# EAGLE schematic ShiftReg (EAGLE 8.5.1)
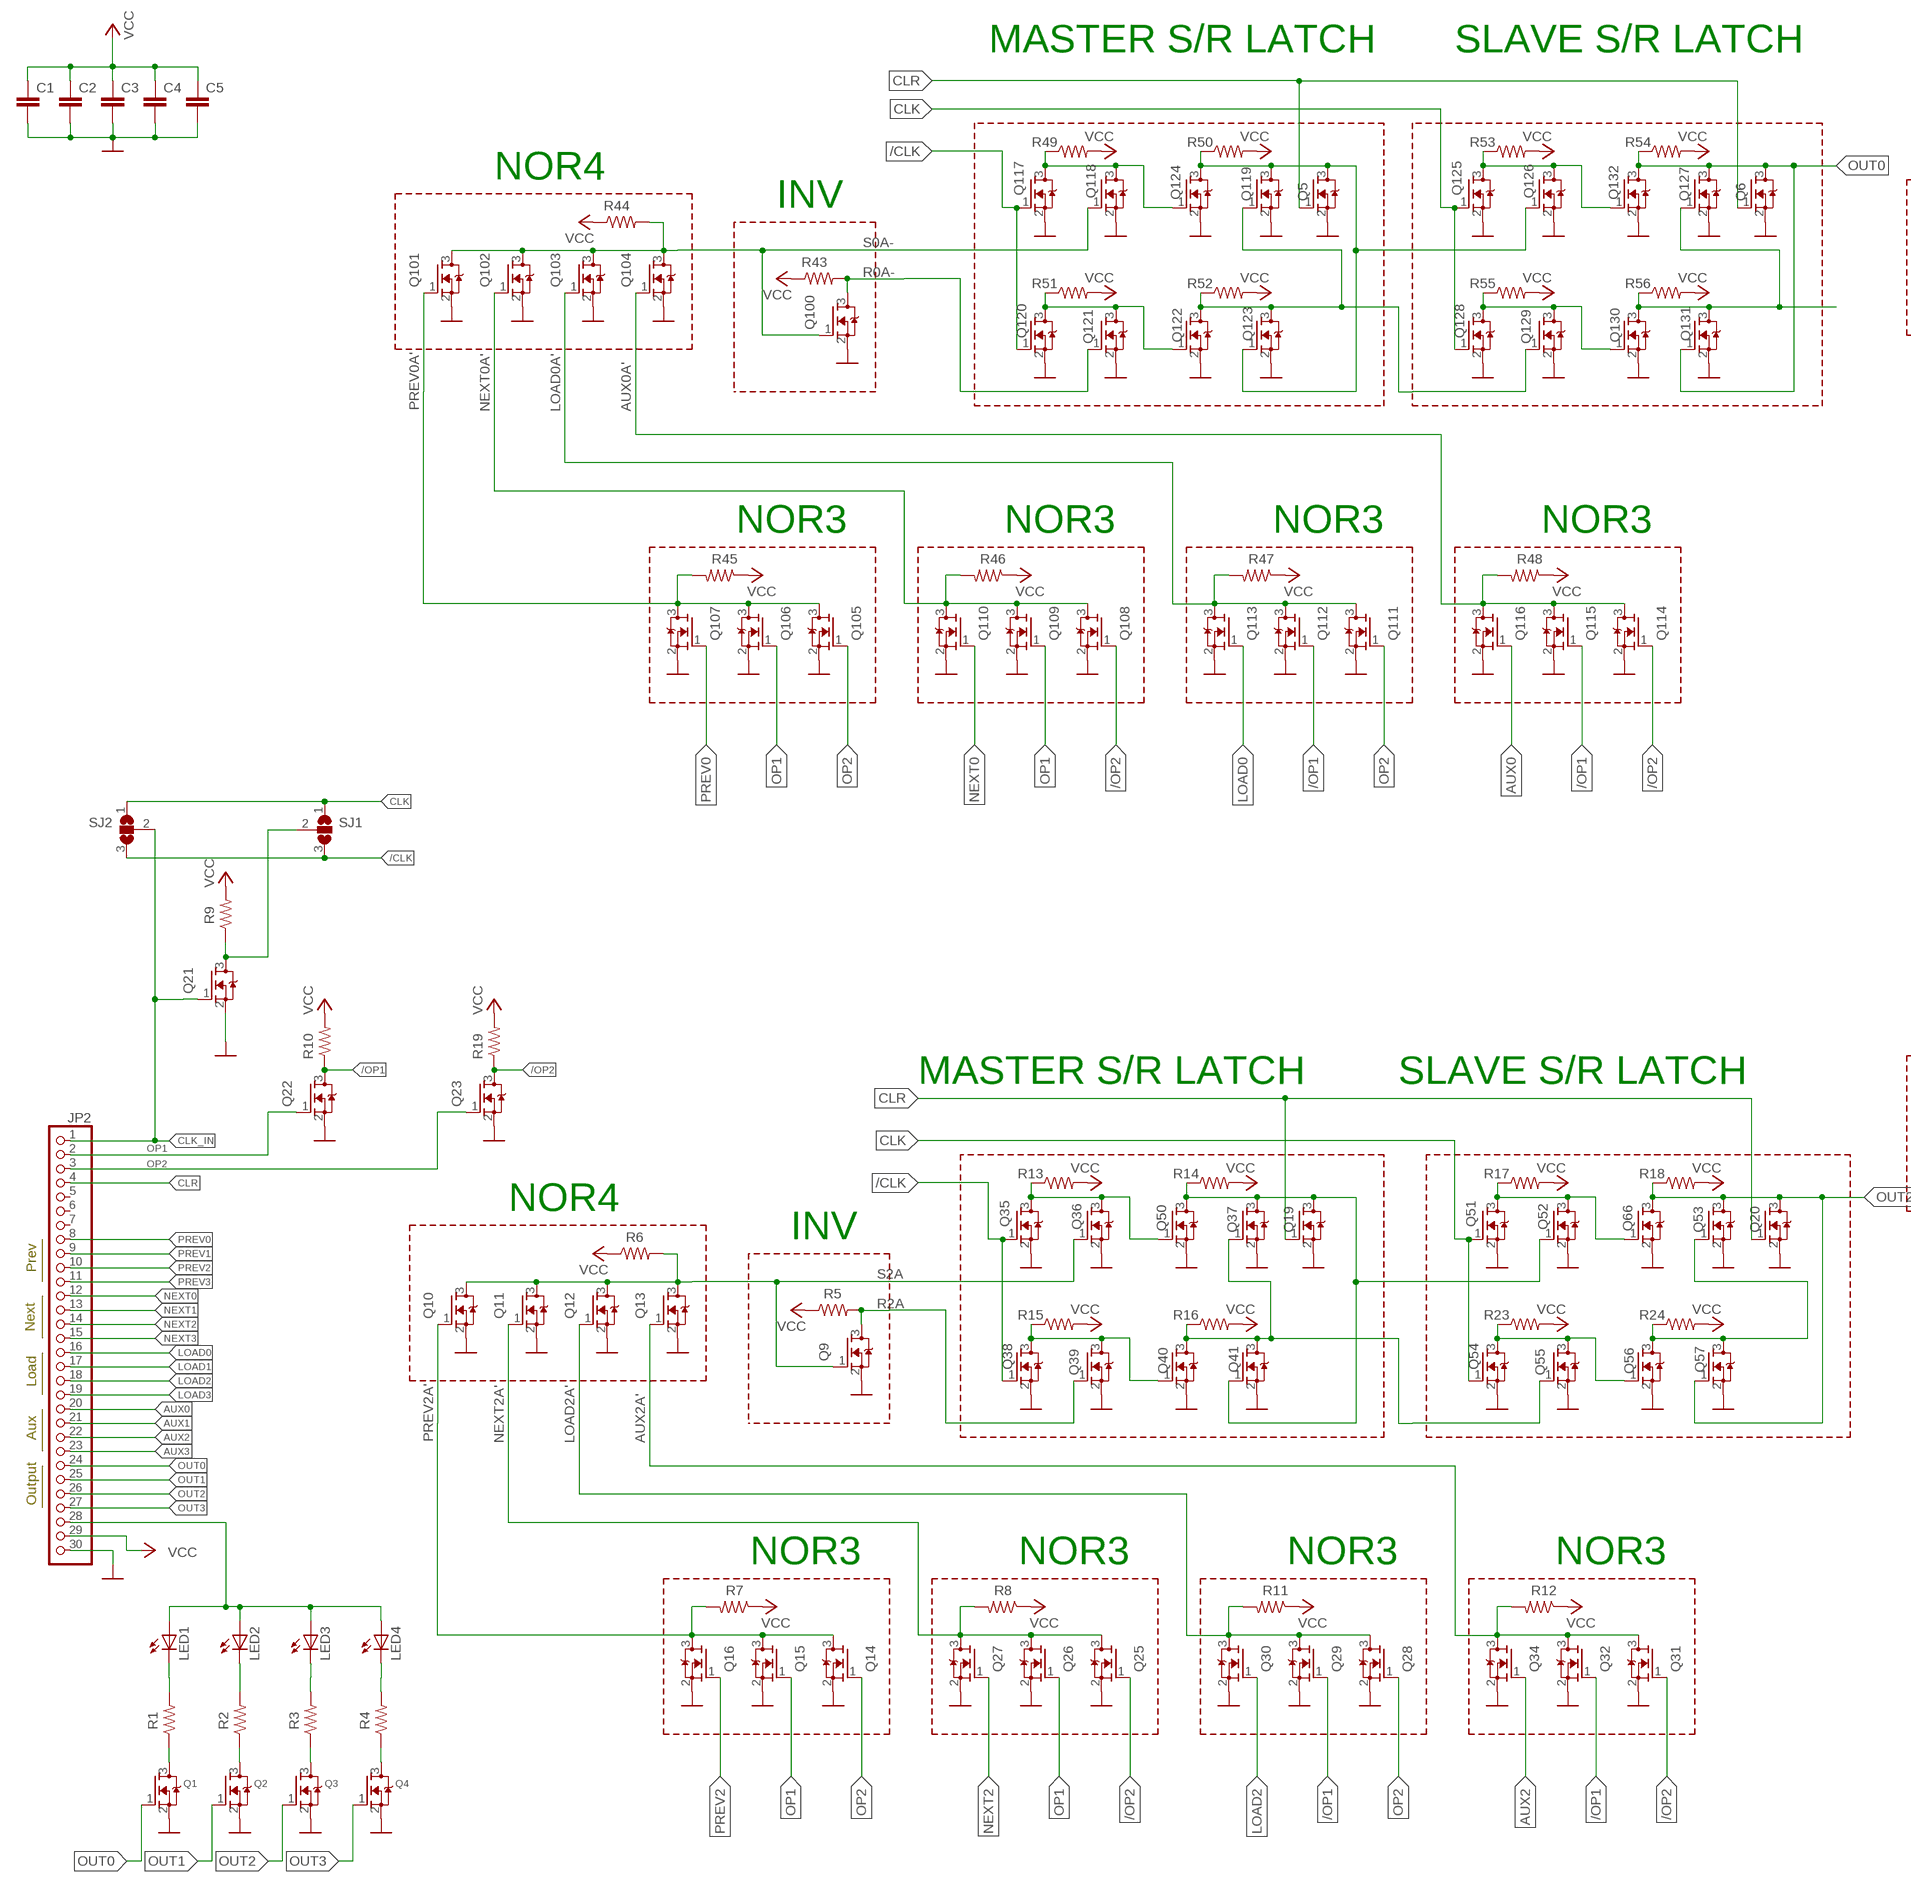
[diagram p0: schematic, sheet 1, part 1 of 2]
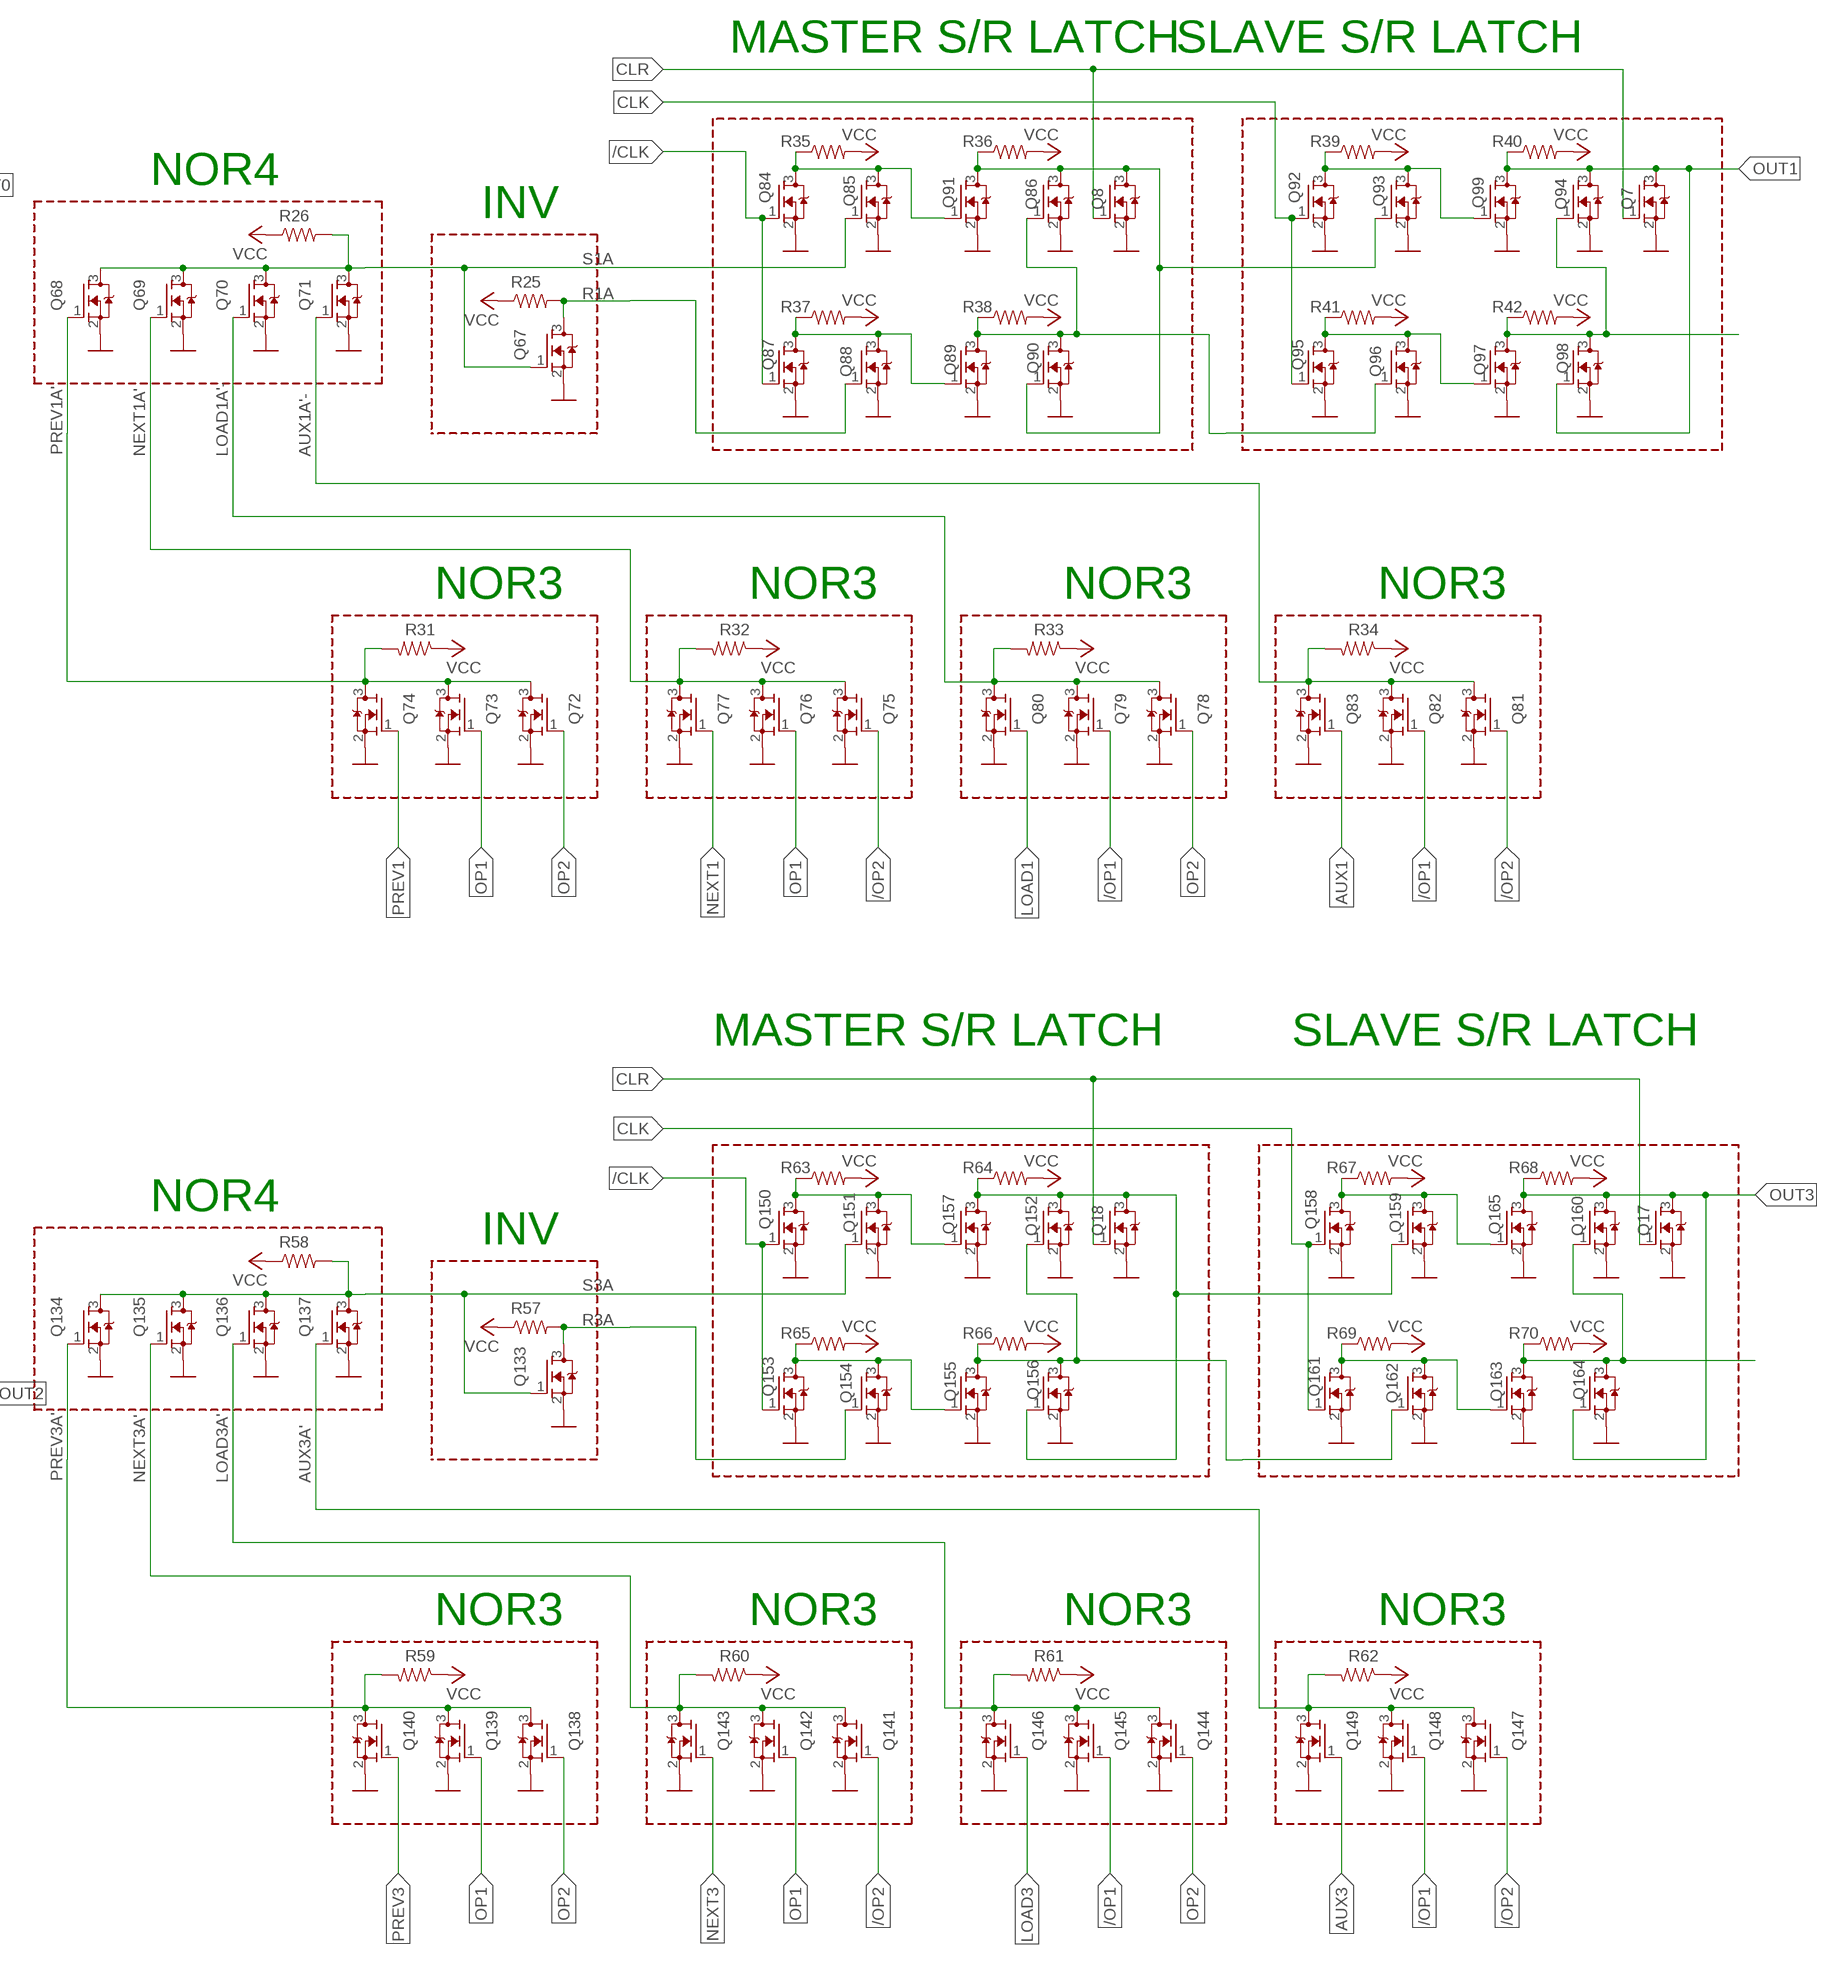
[diagram p1: schematic, sheet 1, part 2 of 2]

## Parts
C1  C-EUC0805K  [C0805K]
C2  C-EUC0805K  [C0805K]
C3  C-EUC0805K  [C0805K]
C4  C-EUC0805K  [C0805K]
C5  C-EUC0805K  [C0805K]
JP2  PINHD-1X30  [1X30]
LED1  LEDSQR2X5  [LED2X5]
LED2  LEDSQR2X5  [LED2X5]
LED3  LEDSQR2X5  [LED2X5]
LED4  LEDSQR2X5  [LED2X5]
Q1  NMOSREFLOW  [SOT23]
Q2  NMOSREFLOW  [SOT23]
Q3  NMOSREFLOW  [SOT23]
Q4  NMOSREFLOW  [SOT23]
Q5  310mA/60V/1.6Ω  NMOSREFLOW  [SOT23]
Q6  310mA/60V/1.6Ω  NMOSREFLOW  [SOT23]
Q7  310mA/60V/1.6Ω  NMOSREFLOW  [SOT23]
Q8  310mA/60V/1.6Ω  NMOSREFLOW  [SOT23]
Q9  310mA/60V/1.6Ω  NMOSREFLOW  [SOT23]
Q10  310mA/60V/1.6Ω  NMOSREFLOW  [SOT23]
Q11  310mA/60V/1.6Ω  NMOSREFLOW  [SOT23]
Q12  310mA/60V/1.6Ω  NMOSREFLOW  [SOT23]
Q13  310mA/60V/1.6Ω  NMOSREFLOW  [SOT23]
Q14  310mA/60V/1.6Ω  NMOSREFLOW  [SOT23]
Q15  310mA/60V/1.6Ω  NMOSREFLOW  [SOT23]
Q16  310mA/60V/1.6Ω  NMOSREFLOW  [SOT23]
Q17  310mA/60V/1.6Ω  NMOSREFLOW  [SOT23]
Q18  310mA/60V/1.6Ω  NMOSREFLOW  [SOT23]
Q19  310mA/60V/1.6Ω  NMOSREFLOW  [SOT23]
Q20  310mA/60V/1.6Ω  NMOSREFLOW  [SOT23]
Q21  310mA/60V/1.6Ω  NMOSREFLOW  [SOT23]
Q22  310mA/60V/1.6Ω  NMOSREFLOW  [SOT23]
Q23  310mA/60V/1.6Ω  NMOSREFLOW  [SOT23]
Q25  310mA/60V/1.6Ω  NMOSREFLOW  [SOT23]
Q26  310mA/60V/1.6Ω  NMOSREFLOW  [SOT23]
Q27  310mA/60V/1.6Ω  NMOSREFLOW  [SOT23]
Q28  310mA/60V/1.6Ω  NMOSREFLOW  [SOT23]
Q29  310mA/60V/1.6Ω  NMOSREFLOW  [SOT23]
Q30  310mA/60V/1.6Ω  NMOSREFLOW  [SOT23]
Q31  310mA/60V/1.6Ω  NMOSREFLOW  [SOT23]
Q32  310mA/60V/1.6Ω  NMOSREFLOW  [SOT23]
Q34  310mA/60V/1.6Ω  NMOSREFLOW  [SOT23]
Q35  310mA/60V/1.6Ω  NMOSREFLOW  [SOT23]
Q36  310mA/60V/1.6Ω  NMOSREFLOW  [SOT23]
Q37  310mA/60V/1.6Ω  NMOSREFLOW  [SOT23]
Q38  310mA/60V/1.6Ω  NMOSREFLOW  [SOT23]
Q39  310mA/60V/1.6Ω  NMOSREFLOW  [SOT23]
Q40  310mA/60V/1.6Ω  NMOSREFLOW  [SOT23]
Q41  310mA/60V/1.6Ω  NMOSREFLOW  [SOT23]
Q50  310mA/60V/1.6Ω  NMOSREFLOW  [SOT23]
Q51  310mA/60V/1.6Ω  NMOSREFLOW  [SOT23]
Q52  310mA/60V/1.6Ω  NMOSREFLOW  [SOT23]
Q53  310mA/60V/1.6Ω  NMOSREFLOW  [SOT23]
Q54  310mA/60V/1.6Ω  NMOSREFLOW  [SOT23]
Q55  310mA/60V/1.6Ω  NMOSREFLOW  [SOT23]
Q56  310mA/60V/1.6Ω  NMOSREFLOW  [SOT23]
Q57  310mA/60V/1.6Ω  NMOSREFLOW  [SOT23]
Q66  310mA/60V/1.6Ω  NMOSREFLOW  [SOT23]
Q67  310mA/60V/1.6Ω  NMOSREFLOW  [SOT23]
Q68  310mA/60V/1.6Ω  NMOSREFLOW  [SOT23]
Q69  310mA/60V/1.6Ω  NMOSREFLOW  [SOT23]
Q70  310mA/60V/1.6Ω  NMOSREFLOW  [SOT23]
Q71  310mA/60V/1.6Ω  NMOSREFLOW  [SOT23]
Q72  310mA/60V/1.6Ω  NMOSREFLOW  [SOT23]
Q73  310mA/60V/1.6Ω  NMOSREFLOW  [SOT23]
Q74  310mA/60V/1.6Ω  NMOSREFLOW  [SOT23]
Q75  310mA/60V/1.6Ω  NMOSREFLOW  [SOT23]
Q76  310mA/60V/1.6Ω  NMOSREFLOW  [SOT23]
Q77  310mA/60V/1.6Ω  NMOSREFLOW  [SOT23]
Q78  310mA/60V/1.6Ω  NMOSREFLOW  [SOT23]
Q79  310mA/60V/1.6Ω  NMOSREFLOW  [SOT23]
Q80  310mA/60V/1.6Ω  NMOSREFLOW  [SOT23]
Q81  310mA/60V/1.6Ω  NMOSREFLOW  [SOT23]
Q82  310mA/60V/1.6Ω  NMOSREFLOW  [SOT23]
Q83  310mA/60V/1.6Ω  NMOSREFLOW  [SOT23]
Q84  310mA/60V/1.6Ω  NMOSREFLOW  [SOT23]
Q85  310mA/60V/1.6Ω  NMOSREFLOW  [SOT23]
Q86  310mA/60V/1.6Ω  NMOSREFLOW  [SOT23]
Q87  310mA/60V/1.6Ω  NMOSREFLOW  [SOT23]
Q88  310mA/60V/1.6Ω  NMOSREFLOW  [SOT23]
Q89  310mA/60V/1.6Ω  NMOSREFLOW  [SOT23]
Q90  310mA/60V/1.6Ω  NMOSREFLOW  [SOT23]
Q91  310mA/60V/1.6Ω  NMOSREFLOW  [SOT23]
Q92  310mA/60V/1.6Ω  NMOSREFLOW  [SOT23]
Q93  310mA/60V/1.6Ω  NMOSREFLOW  [SOT23]
Q94  310mA/60V/1.6Ω  NMOSREFLOW  [SOT23]
Q95  310mA/60V/1.6Ω  NMOSREFLOW  [SOT23]
Q96  310mA/60V/1.6Ω  NMOSREFLOW  [SOT23]
Q97  310mA/60V/1.6Ω  NMOSREFLOW  [SOT23]
Q98  310mA/60V/1.6Ω  NMOSREFLOW  [SOT23]
Q99  310mA/60V/1.6Ω  NMOSREFLOW  [SOT23]
Q100  310mA/60V/1.6Ω  NMOSREFLOW  [SOT23]
Q101  310mA/60V/1.6Ω  NMOSREFLOW  [SOT23]
Q102  310mA/60V/1.6Ω  NMOSREFLOW  [SOT23]
Q103  310mA/60V/1.6Ω  NMOSREFLOW  [SOT23]
Q104  310mA/60V/1.6Ω  NMOSREFLOW  [SOT23]
Q105  310mA/60V/1.6Ω  NMOSREFLOW  [SOT23]
Q106  310mA/60V/1.6Ω  NMOSREFLOW  [SOT23]
Q107  310mA/60V/1.6Ω  NMOSREFLOW  [SOT23]
Q108  310mA/60V/1.6Ω  NMOSREFLOW  [SOT23]
Q109  310mA/60V/1.6Ω  NMOSREFLOW  [SOT23]
Q110  310mA/60V/1.6Ω  NMOSREFLOW  [SOT23]
Q111  310mA/60V/1.6Ω  NMOSREFLOW  [SOT23]
Q112  310mA/60V/1.6Ω  NMOSREFLOW  [SOT23]
Q113  310mA/60V/1.6Ω  NMOSREFLOW  [SOT23]
Q114  310mA/60V/1.6Ω  NMOSREFLOW  [SOT23]
Q115  310mA/60V/1.6Ω  NMOSREFLOW  [SOT23]
Q116  310mA/60V/1.6Ω  NMOSREFLOW  [SOT23]
Q117  310mA/60V/1.6Ω  NMOSREFLOW  [SOT23]
Q118  310mA/60V/1.6Ω  NMOSREFLOW  [SOT23]
Q119  310mA/60V/1.6Ω  NMOSREFLOW  [SOT23]
Q120  310mA/60V/1.6Ω  NMOSREFLOW  [SOT23]
Q121  310mA/60V/1.6Ω  NMOSREFLOW  [SOT23]
Q122  310mA/60V/1.6Ω  NMOSREFLOW  [SOT23]
Q123  310mA/60V/1.6Ω  NMOSREFLOW  [SOT23]
Q124  310mA/60V/1.6Ω  NMOSREFLOW  [SOT23]
Q125  310mA/60V/1.6Ω  NMOSREFLOW  [SOT23]
Q126  310mA/60V/1.6Ω  NMOSREFLOW  [SOT23]
Q127  310mA/60V/1.6Ω  NMOSREFLOW  [SOT23]
Q128  310mA/60V/1.6Ω  NMOSREFLOW  [SOT23]
Q129  310mA/60V/1.6Ω  NMOSREFLOW  [SOT23]
Q130  310mA/60V/1.6Ω  NMOSREFLOW  [SOT23]
Q131  310mA/60V/1.6Ω  NMOSREFLOW  [SOT23]
Q132  310mA/60V/1.6Ω  NMOSREFLOW  [SOT23]
Q133  310mA/60V/1.6Ω  NMOSREFLOW  [SOT23]
Q134  310mA/60V/1.6Ω  NMOSREFLOW  [SOT23]
Q135  310mA/60V/1.6Ω  NMOSREFLOW  [SOT23]
Q136  310mA/60V/1.6Ω  NMOSREFLOW  [SOT23]
Q137  310mA/60V/1.6Ω  NMOSREFLOW  [SOT23]
Q138  310mA/60V/1.6Ω  NMOSREFLOW  [SOT23]
Q139  310mA/60V/1.6Ω  NMOSREFLOW  [SOT23]
Q140  310mA/60V/1.6Ω  NMOSREFLOW  [SOT23]
Q141  310mA/60V/1.6Ω  NMOSREFLOW  [SOT23]
Q142  310mA/60V/1.6Ω  NMOSREFLOW  [SOT23]
Q143  310mA/60V/1.6Ω  NMOSREFLOW  [SOT23]
Q144  310mA/60V/1.6Ω  NMOSREFLOW  [SOT23]
Q145  310mA/60V/1.6Ω  NMOSREFLOW  [SOT23]
Q146  310mA/60V/1.6Ω  NMOSREFLOW  [SOT23]
Q147  310mA/60V/1.6Ω  NMOSREFLOW  [SOT23]
Q148  310mA/60V/1.6Ω  NMOSREFLOW  [SOT23]
Q149  310mA/60V/1.6Ω  NMOSREFLOW  [SOT23]
Q150  310mA/60V/1.6Ω  NMOSREFLOW  [SOT23]
Q151  310mA/60V/1.6Ω  NMOSREFLOW  [SOT23]
Q152  310mA/60V/1.6Ω  NMOSREFLOW  [SOT23]
Q153  310mA/60V/1.6Ω  NMOSREFLOW  [SOT23]
Q154  310mA/60V/1.6Ω  NMOSREFLOW  [SOT23]
Q155  310mA/60V/1.6Ω  NMOSREFLOW  [SOT23]
Q156  310mA/60V/1.6Ω  NMOSREFLOW  [SOT23]
Q157  310mA/60V/1.6Ω  NMOSREFLOW  [SOT23]
Q158  310mA/60V/1.6Ω  NMOSREFLOW  [SOT23]
Q159  310mA/60V/1.6Ω  NMOSREFLOW  [SOT23]
Q160  310mA/60V/1.6Ω  NMOSREFLOW  [SOT23]
Q161  310mA/60V/1.6Ω  NMOSREFLOW  [SOT23]
Q162  310mA/60V/1.6Ω  NMOSREFLOW  [SOT23]
Q163  310mA/60V/1.6Ω  NMOSREFLOW  [SOT23]
Q164  310mA/60V/1.6Ω  NMOSREFLOW  [SOT23]
Q165  310mA/60V/1.6Ω  NMOSREFLOW  [SOT23]
R1  RESISTOR0805  [0805]
R2  RESISTOR0805  [0805]
R3  RESISTOR0805  [0805]
R4  RESISTOR0805  [0805]
R5  RESISTOR0805  [0805]
R6  RESISTOR0805  [0805]
R7  RESISTOR0805  [0805]
R8  RESISTOR0805  [0805]
R9  RESISTOR0805  [0805]
R10  RESISTOR0805  [0805]
R11  RESISTOR0805  [0805]
R12  RESISTOR0805  [0805]
R13  RESISTOR0805  [0805]
R14  RESISTOR0805  [0805]
R15  RESISTOR0805  [0805]
R16  RESISTOR0805  [0805]
R17  RESISTOR0805  [0805]
R18  RESISTOR0805  [0805]
R19  RESISTOR0805  [0805]
R23  RESISTOR0805  [0805]
R24  RESISTOR0805  [0805]
R25  RESISTOR0805  [0805]
R26  RESISTOR0805  [0805]
R31  RESISTOR0805  [0805]
R32  RESISTOR0805  [0805]
R33  RESISTOR0805  [0805]
R34  RESISTOR0805  [0805]
R35  RESISTOR0805  [0805]
R36  RESISTOR0805  [0805]
R37  RESISTOR0805  [0805]
R38  RESISTOR0805  [0805]
R39  RESISTOR0805  [0805]
R40  RESISTOR0805  [0805]
R41  RESISTOR0805  [0805]
R42  RESISTOR0805  [0805]
R43  RESISTOR0805  [0805]
R44  RESISTOR0805  [0805]
R45  RESISTOR0805  [0805]
R46  RESISTOR0805  [0805]
R47  RESISTOR0805  [0805]
R48  RESISTOR0805  [0805]
R49  RESISTOR0805  [0805]
R50  RESISTOR0805  [0805]
R51  RESISTOR0805  [0805]
R52  RESISTOR0805  [0805]
R53  RESISTOR0805  [0805]
R54  RESISTOR0805  [0805]
R55  RESISTOR0805  [0805]
R56  RESISTOR0805  [0805]
R57  RESISTOR0805  [0805]
R58  RESISTOR0805  [0805]
R59  RESISTOR0805  [0805]
R60  RESISTOR0805  [0805]
R61  RESISTOR0805  [0805]
R62  RESISTOR0805  [0805]
R63  RESISTOR0805  [0805]
R64  RESISTOR0805  [0805]
R65  RESISTOR0805  [0805]
R66  RESISTOR0805  [0805]
R67  RESISTOR0805  [0805]
R68  RESISTOR0805  [0805]
R69  RESISTOR0805  [0805]
R70  RESISTOR0805  [0805]
SJ1  SJ2W  [SJ_2]
SJ2  SJ2W  [SJ_2]

## Nets
/CLK: Q35.1(G) Q38.1(G) Q84.1(G) Q87.1(G) Q117.1(G) Q120.1(G) Q150.1(G) Q153.1(G) SJ1.3 SJ2.3
/OP1: Q22.3(D) Q29.1(G) Q32.1(G) Q79.1(G) Q82.1(G) Q112.1(G) Q115.1(G) Q145.1(G) Q148.1(G) R10.1
/OP2: Q23.3(D) Q25.1(G) Q31.1(G) Q75.1(G) Q81.1(G) Q108.1(G) Q114.1(G) Q141.1(G) Q147.1(G) R19.1
AUX0: JP2.20 Q116.1(G)
AUX0A': Q104.1(G) Q114.3(D) Q115.3(D) Q116.3(D) R48.2
AUX1: JP2.21 Q83.1(G)
AUX1A'-: Q71.1(G) Q81.3(D) Q82.3(D) Q83.3(D) R34.2
AUX2: JP2.22 Q34.1(G)
AUX2A': Q13.1(G) Q31.3(D) Q32.3(D) Q34.3(D) R12.2
AUX3: JP2.23 Q149.1(G)
AUX3A': Q137.1(G) Q147.3(D) Q148.3(D) Q149.3(D) R62.2
CLK: Q51.1(G) Q54.1(G) Q92.1(G) Q95.1(G) Q125.1(G) Q128.1(G) Q158.1(G) Q161.1(G) SJ1.1 SJ2.1
CLK_IN: JP2.1 Q21.1(G) SJ2.2
CLR: JP2.4 Q5.1(G) Q6.1(G) Q7.1(G) Q8.1(G) Q17.1(G) Q18.1(G) Q19.1(G) Q20.1(G)
GND: C1.2 C2.2 C3.2 C4.2 C5.2 JP2.30 Q1.2(S) Q2.2(S) Q3.2(S) Q4.2(S) Q5.2(S) Q6.2(S) Q7.2(S) Q8.2(S) Q9.2(S) Q10.2(S) Q11.2(S) Q12.2(S) Q13.2(S) Q14.2(S) Q15.2(S) Q16.2(S) Q17.2(S) Q18.2(S) Q19.2(S) Q20.2(S) Q21.2(S) Q22.2(S) Q23.2(S) Q25.2(S) Q26.2(S) Q27.2(S) Q28.2(S) Q29.2(S) Q30.2(S) Q31.2(S) Q32.2(S) Q34.2(S) Q35.2(S) Q36.2(S) Q37.2(S) Q38.2(S) Q39.2(S) Q40.2(S) Q41.2(S) Q50.2(S) Q51.2(S) Q52.2(S) Q53.2(S) Q54.2(S) Q55.2(S) Q56.2(S) Q57.2(S) Q66.2(S) Q67.2(S) Q68.2(S) Q69.2(S) Q70.2(S) Q71.2(S) Q72.2(S) Q73.2(S) Q74.2(S) Q75.2(S) Q76.2(S) Q77.2(S) Q78.2(S) Q79.2(S) Q80.2(S) Q81.2(S) Q82.2(S) Q83.2(S) Q84.2(S) Q85.2(S) Q86.2(S) Q87.2(S) Q88.2(S) Q89.2(S) Q90.2(S) Q91.2(S) Q92.2(S) Q93.2(S) Q94.2(S) Q95.2(S) Q96.2(S) Q97.2(S) Q98.2(S) Q99.2(S) Q100.2(S) Q101.2(S) Q102.2(S) Q103.2(S) Q104.2(S) Q105.2(S) Q106.2(S) Q107.2(S) Q108.2(S) Q109.2(S) Q110.2(S) Q111.2(S) Q112.2(S) Q113.2(S) Q114.2(S) Q115.2(S) Q116.2(S) Q117.2(S) Q118.2(S) Q119.2(S) Q120.2(S) Q121.2(S) Q122.2(S) Q123.2(S) Q124.2(S) Q125.2(S) Q126.2(S) Q127.2(S) Q128.2(S) Q129.2(S) Q130.2(S) Q131.2(S) Q132.2(S) Q133.2(S) Q134.2(S) Q135.2(S) Q136.2(S) Q137.2(S) Q138.2(S) Q139.2(S) Q140.2(S) Q141.2(S) Q142.2(S) Q143.2(S) Q144.2(S) Q145.2(S) Q146.2(S) Q147.2(S) Q148.2(S) Q149.2(S) Q150.2(S) Q151.2(S) Q152.2(S) Q153.2(S) Q154.2(S) Q155.2(S) Q156.2(S) Q157.2(S) Q158.2(S) Q159.2(S) Q160.2(S) Q161.2(S) Q162.2(S) Q163.2(S) Q164.2(S) Q165.2(S)
LED+: JP2.28 LED1.A LED2.A LED3.A LED4.A
LOAD0: JP2.16 Q113.1(G)
LOAD0A': Q103.1(G) Q111.3(D) Q112.3(D) Q113.3(D) R47.2
LOAD1: JP2.17 Q80.1(G)
LOAD1A'-: Q70.1(G) Q78.3(D) Q79.3(D) Q80.3(D) R33.2
LOAD2: JP2.18 Q30.1(G)
LOAD2A': Q12.1(G) Q28.3(D) Q29.3(D) Q30.3(D) R11.2
LOAD3: JP2.19 Q146.1(G)
LOAD3A': Q136.1(G) Q144.3(D) Q145.3(D) Q146.3(D) R61.2
N$1: Q35.3(D) Q36.3(D) Q50.1(G) R13.1
N$2: Q38.3(D) Q39.3(D) Q40.1(G) R15.1
N$3: Q21.3(D) R9.1 SJ1.2
N$4: Q51.3(D) Q52.3(D) Q66.1(G) R17.1
N$5: Q1.3(D) R1.1
N$6: Q2.3(D) R2.1
N$7: Q54.3(D) Q55.3(D) Q56.1(G) R23.1
N$8: Q84.3(D) Q85.3(D) Q91.1(G) R35.1
N$9: Q87.3(D) Q88.3(D) Q89.1(G) R37.1
N$10: Q92.3(D) Q93.3(D) Q99.1(G) R39.1
N$11: Q95.3(D) Q96.3(D) Q97.1(G) R41.1
N$12: Q150.3(D) Q151.3(D) Q157.1(G) R63.1
N$13: Q153.3(D) Q154.3(D) Q155.1(G) R65.1
N$14: Q158.3(D) Q159.3(D) Q165.1(G) R67.1
N$15: Q161.3(D) Q162.3(D) Q163.1(G) R69.1
N$16: Q117.3(D) Q118.3(D) Q124.1(G) R49.1
N$17: Q120.3(D) Q121.3(D) Q122.1(G) R51.1
N$18: Q125.3(D) Q126.3(D) Q132.1(G) R53.1
N$19: Q128.3(D) Q129.3(D) Q130.1(G) R55.1
N$20: Q3.3(D) R3.1
N$21: Q4.3(D) R4.1
N$22: LED4.K(C) R4.2
N$23: LED3.K(C) R3.2
N$24: LED2.K(C) R2.2
N$25: LED1.K(C) R1.2
N$100: Q5.3(D) Q119.3(D) Q123.1(G) Q124.3(D) Q126.1(G) R50.1
N$101: Q119.1(G) Q122.3(D) Q123.3(D) Q129.1(G) R52.1
N$102: Q127.1(G) Q130.3(D) Q131.3(D) R56.1
N$103: Q86.1(G) Q89.3(D) Q90.3(D) Q96.1(G) R38.1
N$104: Q8.3(D) Q86.3(D) Q90.1(G) Q91.3(D) Q93.1(G) R36.1
N$105: Q94.1(G) Q97.3(D) Q98.3(D) R42.1
N$110: Q53.1(G) Q56.3(D) Q57.3(D) R24.1
N$111: Q37.1(G) Q40.3(D) Q41.3(D) Q55.1(G) R16.1
N$112: Q19.3(D) Q37.3(D) Q41.1(G) Q50.3(D) Q52.1(G) R14.1
N$113: Q160.1(G) Q163.3(D) Q164.3(D) R70.1
N$114: Q152.1(G) Q155.3(D) Q156.3(D) Q162.1(G) R66.1
N$115: Q18.3(D) Q152.3(D) Q156.1(G) Q157.3(D) Q159.1(G) R64.1
NEXT0: JP2.12 Q110.1(G)
NEXT0A': Q102.1(G) Q108.3(D) Q109.3(D) Q110.3(D) R46.2
NEXT1: JP2.13 Q77.1(G)
NEXT1A': Q69.1(G) Q75.3(D) Q76.3(D) Q77.3(D) R32.2
NEXT2: JP2.14 Q27.1(G)
NEXT2A': Q11.1(G) Q25.3(D) Q26.3(D) Q27.3(D) R8.2
NEXT3: JP2.15 Q143.1(G)
NEXT3A': Q135.1(G) Q141.3(D) Q142.3(D) Q143.3(D) R60.2
OP1: JP2.2 Q15.1(G) Q22.1(G) Q26.1(G) Q73.1(G) Q76.1(G) Q106.1(G) Q109.1(G) Q139.1(G) Q142.1(G)
OP2: JP2.3 Q14.1(G) Q23.1(G) Q28.1(G) Q72.1(G) Q78.1(G) Q105.1(G) Q111.1(G) Q138.1(G) Q144.1(G)
OUT0: JP2.24 Q1.1(G) Q6.3(D) Q127.3(D) Q131.1(G) Q132.3(D) R54.1
OUT1: JP2.25 Q2.1(G) Q7.3(D) Q94.3(D) Q98.1(G) Q99.3(D) R40.1
OUT2: JP2.26 Q3.1(G) Q20.3(D) Q53.3(D) Q57.1(G) Q66.3(D) R18.1
OUT3: JP2.27 Q4.1(G) Q17.3(D) Q160.3(D) Q164.1(G) Q165.3(D) R68.1
PREV0: JP2.8 Q107.1(G)
PREV0A': Q101.1(G) Q105.3(D) Q106.3(D) Q107.3(D) R45.2
PREV1: JP2.9 Q74.1(G)
PREV1A': Q68.1(G) Q72.3(D) Q73.3(D) Q74.3(D) R31.2
PREV2: JP2.10 Q16.1(G)
PREV2A': Q10.1(G) Q14.3(D) Q15.3(D) Q16.3(D) R7.2
PREV3: JP2.11 Q140.1(G)
PREV3A': Q134.1(G) Q138.3(D) Q139.3(D) Q140.3(D) R59.2
R0A-: Q100.3(D) Q121.1(G) R43.2
R1A: Q67.3(D) Q88.1(G) R25.2
R2A: Q9.3(D) Q39.1(G) R5.2
R3A: Q133.3(D) Q154.1(G) R57.2
S0A-: Q100.1(G) Q101.3(D) Q102.3(D) Q103.3(D) Q104.3(D) Q118.1(G) R44.2
S1A: Q67.1(G) Q68.3(D) Q69.3(D) Q70.3(D) Q71.3(D) Q85.1(G) R26.2
S2A: Q9.1(G) Q10.3(D) Q11.3(D) Q12.3(D) Q13.3(D) Q36.1(G) R6.2
S3A: Q133.1(G) Q134.3(D) Q135.3(D) Q136.3(D) Q137.3(D) Q151.1(G) R58.2
VCC: C1.1 C2.1 C3.1 C4.1 C5.1 JP2.29 R5.1 R6.1 R7.1 R8.1 R9.2 R10.2 R11.1 R12.1 R13.2 R14.2 R15.2 R16.2 R17.2 R18.2 R19.2 R23.2 R24.2 R25.1 R26.1 R31.1 R32.1 R33.1 R34.1 R35.2 R36.2 R37.2 R38.2 R39.2 R40.2 R41.2 R42.2 R43.1 R44.1 R45.1 R46.1 R47.1 R48.1 R49.2 R50.2 R51.2 R52.2 R53.2 R54.2 R55.2 R56.2 R57.1 R58.1 R59.1 R60.1 R61.1 R62.1 R63.2 R64.2 R65.2 R66.2 R67.2 R68.2 R69.2 R70.2
Unconnected: JP2.5 JP2.6 JP2.7

## Notes on the sheet
- MASTER S/R LATCH | SLAVE S/R LATCH | MASTER S/R LATCH | SLAVE S/R LATCH
- NOR4
- NOR4
- INV
- INV
- NOR3 | NOR3 | NOR3 | NOR3
- NOR3 | NOR3 | NOR3 | NOR3
- MASTER S/R LATCH | SLAVE S/R LATCH
- NOR4
- INV
- MASTER S/R LATCH | SLAVE S/R LATCH
- NOR4
- INV
- Prev
- Next
- Load
- NOR3 | NOR3 | NOR3 | NOR3
- Aux
- Output
- NOR3 | NOR3 | NOR3 | NOR3

## Library data of the parts
C1-C5 = rcl:C-EU: CAPACITOR, European symbol; SPICEPREFIX: C
JP2 = XSNOR:PINHD-1X30: PIN HEADER
LED1-LED4 = led:LED: LED OSRAM: - CHIPLED LG R971, LG N971, LY N971, LG Q971, LY Q971, LO R971, LY R971 LH N974, LH R974 LS Q976, LO Q976, LY Q976 LO Q996 - Hyper CHIPLED LW Q18S LB Q993, LB Q99A, LB R99A - SideLED LS A670, LO A670, LY A670, LG A670, LP A670 LB A673, LV A673, LT A673, LW A673 LH A674 LY A675 LS A676, LA A676, LO A676, LY A676, LW A676 LS A679, LY A679, LG A679 - Hyper Micro SIDELED® LS Y876, LA Y876, LO Y876, LY Y876 LT Y87S - SmartLED LW L88C, LW L88S LB L89C, LB L89S, LG L890 LS L89K, LO L89K, LY L89K LS L896, LA L896, LO L896, LY L896 - TOPLED LS T670, LO T670, LY T670, LG T670, LP T670 LSG T670, LSP T670, LSY T670, LOP T670, LYG T670 LG T671, LOG T671, LSG T671 LB T673, LV T673, LT T673, LW T673 LH T674 LS T676, LA T676, LO T676, LY T676, LB T676, LH T676, LSB T676, LW T676 LB T67C, LV T67C, LT T67C, LS T67K, LO T67K, LY T67K, LW E67C LS E67B, LA E67B, LO E67B, LY E67B, LB E67C, LV E67C, LT E67C LW T67C LS T679, LY T679, LG T679 LS T770, LO T770, LY T770, LG T770, LP T770 LB T773, LV T773, LT T773, LW T773 LH T774 LS E675, LA E675, LY E675, LS T675 LS T776, LA T776, LO T776, LY T776, LB T776 LHGB T686 LT T68C, LB T68C - Hyper Mini TOPLED® LB M676 - Mini TOPLED Santana® LG M470 LS M47K, LO M47K, LY M47K Source: http://www.osram.convergy.de LUXEON: - LUMILED® LXK2-PW12-R00, LXK2-PW12-S00, LXK2-PW14-U00, LXK2-PW14-V00 LXK2-PM12-R00, LXK2-PM12-S00, LXK2-PM14-U00 LXK2-PE12-Q00, LXK2-PE12-R00, LXK2-PE12-S00, LXK2-PE14-T00, LXK2-PE14-U00 LXK2-PB12-K00, LXK2-PB12-L00, LXK2-PB12-M00, LXK2-PB14-N00, LXK2-PB14-P00, LXK2-PB14-Q00 LXK2-PR12-L00, LXK2-PR12-M00, LXK2-PR14-Q00, LXK2-PR14-R00 LXK2-PD12-Q00, LXK2-PD12-R00, LXK2-PD12-S00 LXK2-PH12-R00, LXK2-PH12-S00 LXK2-PL12-P00, LXK2-PL12-Q00, LXK2-PL12-R00 Source: www.luxeon.com KINGBRIGHT: KA-3528ASYC Source: www.kingbright.com
Q1-Q23 Q25-Q32 Q34 Q36-Q41 Q52-Q57 Q67-Q83 Q85-Q90 Q93-Q98 Q100-Q116 Q118-Q123 Q126-Q131 Q133-Q149 Q151-Q156 Q159-Q164 = XSNOR:NMOS: N-Channel Mosfet 2N7002E - 60V 260mA SOT23 [Digikey: 2N7002ET1GOSTR-ND] - REEL BSH103 - 30V 850mA SOT23 [Digikey: 568-5013-1-ND]
Q35 Q50 Q51 Q66 Q84 Q91 Q92 Q99 Q117 Q124 Q125 Q132 Q150 Q157 Q158 Q165 = XSNOR:NMOS: N-Channel Mosfet 2N7002E - 60V 260mA SOT23 [Digikey: 2N7002ET1GOSTR-ND] - REEL BSH103 - 30V 850mA SOT23 [Digikey: 568-5013-1-ND]; SPICEPREFIX: M
R1-R19 R23-R26 R31-R70 = XSNOR:RESISTOR: Generic Resistor Package
SJ1 SJ2 = jumper:SJ2W: SMD solder JUMPER

## Net classes
0 default: width 0.2 mm, drill 0.305 mm, clearance 0.2 mm